# EasyEDA Pro project py32f002asop8v1.eprj

# Schematic PY32F002A
Create Date: 2024-02-05; Page Name: P1; Project Name: py32f002asop8v1; Schematic Name: PY32F002A; Update Date: 2024-02-05; Company: 嘉立创EDA; Page Size: A4; Version: V1.0
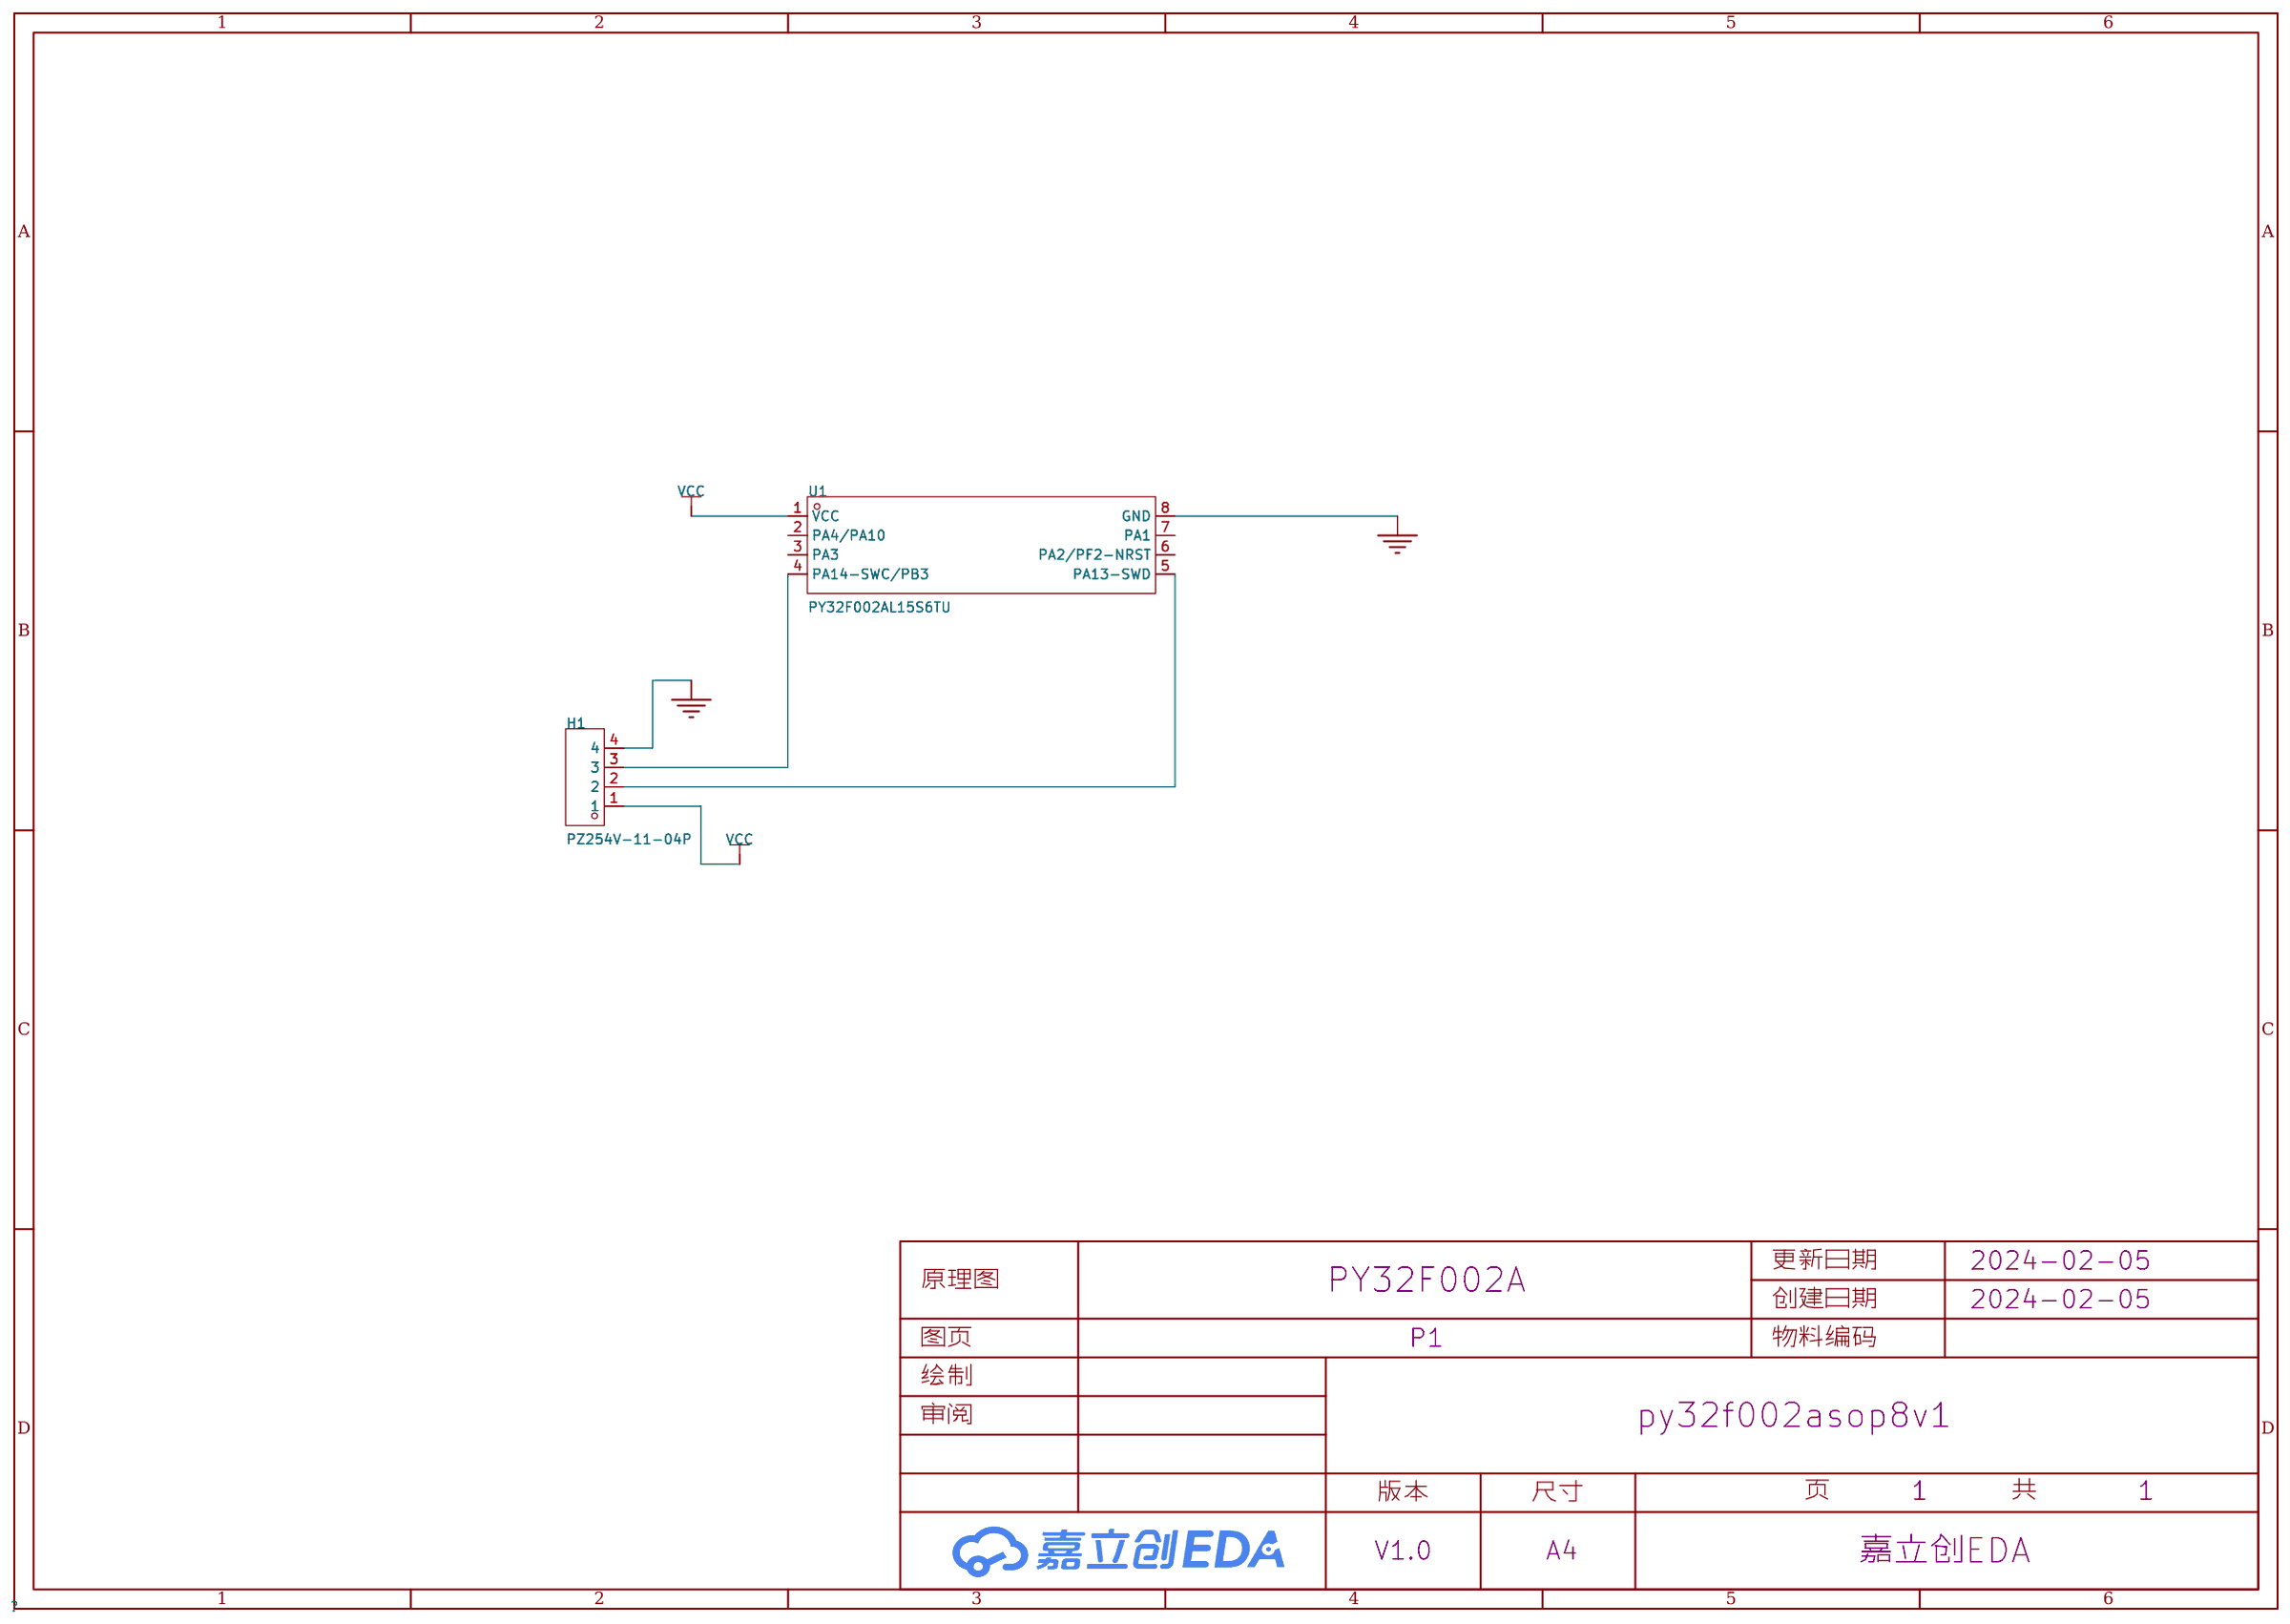
[diagram p0: schematic sheet]

## Parts
H1  PZ254V-11-04P  [HDR-TH_4P-P2.54-V-M]
U1  PY32F002AL15S6TU  [SOP-8_L4.9-W3.9-P1.27-LS6.0-BL-1]

## Library data of the parts
H1 = PZ254V-11-04P: 插针结构:1x4P;间距:2.54mm;行距:-;圆针/方针:方针;安装类型:直插;排数:单排;总PIN位数:4P;额定电流:3A;额定电压:250V;配合针长度:6mm;塑高:2.5mm;端接针长度:3mm;触头材质:-;工作温度范围:-40℃~+105℃;颜色:黑色;; LCSC Part Name: 间距:2.54mm 1x4P 直插 方针; Supplier Part: C2691448; Manufacturer: XFCN(兴飞); Supplier Footprint: 插件,P=2.54mm; JLCPCB Part Class: 扩展库; Datasheet: https://atta.szlcsc.com/upload/public/pdf/source/20200309/C492403_F9F19131791D08044AD4F84F8E751A34.pdf; Supplier: LCSC; Pin Structure: 1x4P; Pitch: 2.54mm; Circluar Pins/Square Pins: 方针; Mounting Type: 直插; Number of Rows: 单排; Number of Pins: 4P; Current Rating (Max): 3A; Voltage Rating (Max): 250V; Length of Mating Pin: 6mm; Insulation Height: 2.5mm; Length of End Connection Pin: 3mm; Operating Temperature Range: -40℃~+105℃; Color: 黑色
U1 = PY32F002AL15S6TU: 程序存储容量:20KB;RAM总容量:3KB;工作电压范围:1.7V~5.5V;CPU最大主频:24MHz;程序存储器类型:FLASH;; LCSC Part Name: 32位微控制器 单片机 PY32F002AL15S6TU; Supplier Part: C5292060; Manufacturer: PUYA(普冉); Supplier Footprint: SOP-8; JLCPCB Part Class: 扩展库; Datasheet: https://atta.szlcsc.com/upload/public/pdf/source/20230327/672347329C675A87241B0153A51AEBC2.pdf; Supplier: LCSC; Program Storage Size: 20KB; RAM Size: 3KB; Operating Voltage Range: 1.7V~5.5V; CPU Maximum Speed: 24MHz; Program Memory Type: FLASH; ADC (Bit): 12bit

## Nets
GND: H1.4 U1.8(GND)
VCC: H1.1 U1.1(VCC)
Net-(H1-2): H1.2 U1.5(PA13-SWD)
Net-(H1-3): H1.3 U1.4(PA14-SWC/PB3)

Not connected (* = marked no-connect by the designer): U1 2(PA4/PA10) 3(PA3) 6(PA2/PF2-NRST) 7(PA1)
